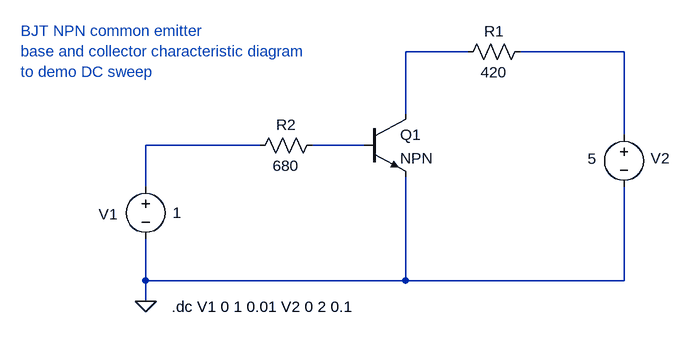
[diagram p0: schematic 04-BJT-NPN-comm-emitter-DC-sweep.asc]
04-BJT-NPN-comm-emitter-DC-sweep.asc, the LTspice schematic file:
Version 4
SHEET 1 880 680
WIRE 256 -16 160 -16
WIRE 496 -16 336 -16
WIRE 160 80 160 -16
WIRE 496 112 496 -16
WIRE -64 128 -240 128
WIRE 96 128 16 128
WIRE -240 192 -240 128
WIRE -240 336 -240 272
WIRE 160 336 160 176
WIRE 160 336 -240 336
WIRE 496 336 496 192
WIRE 496 336 160 336
WIRE -240 368 -240 336
FLAG -240 368 0
SYMBOL npn 96 80 R0
SYMATTR InstName Q1
SYMBOL res 352 -32 R90
WINDOW 0 0 56 VBottom 2
WINDOW 3 32 56 VTop 2
SYMATTR InstName R1
SYMATTR Value 420
SYMBOL voltage -240 176 R0
WINDOW 0 -72 58 Left 2
WINDOW 3 42 56 Left 2
WINDOW 123 0 0 Left 0
WINDOW 39 0 0 Left 0
SYMATTR InstName V1
SYMATTR Value 1
SYMBOL voltage 496 96 R0
WINDOW 0 41 52 Left 2
WINDOW 3 -56 53 Left 2
WINDOW 123 0 0 Left 0
WINDOW 39 0 0 Left 0
SYMATTR InstName V2
SYMATTR Value 5
SYMBOL res 32 112 R90
WINDOW 0 0 56 VBottom 2
WINDOW 3 32 56 VTop 2
SYMATTR InstName R2
SYMATTR Value 680
TEXT -432 -48 Left 2 ;BJT NPN common emitter\nbase and collector characteristic diagram\nto demo DC sweep
TEXT -200 376 Left 2 !.dc V1 0 1 0.01 V2 0 2 0.1

The netlist it stands for:
* 04-BJT-NPN-comm-emitter-DC-sweep.asc
Q1 N001 N004 0 0 NPN
R1 N002 N001 420
V1 N003 0 1
V2 N002 0 5
R2 N004 N003 680
.model NPN NPN
.model PNP PNP
.lib standard.bjt
* BJT NPN common emitter
* base and collector characteristic diagram
* to demo DC sweep
.dc V1 0 1 0.01 V2 0 2 0.1
.backanno
.end